# EasyEDA schematic seedrum_mosfet_v1.json
TITLE: Seedup Relay; REV: 1.0; Date: 2020-10-29; Sheet: 1/1; Drawn By: Victor Halla; Company: Seedup
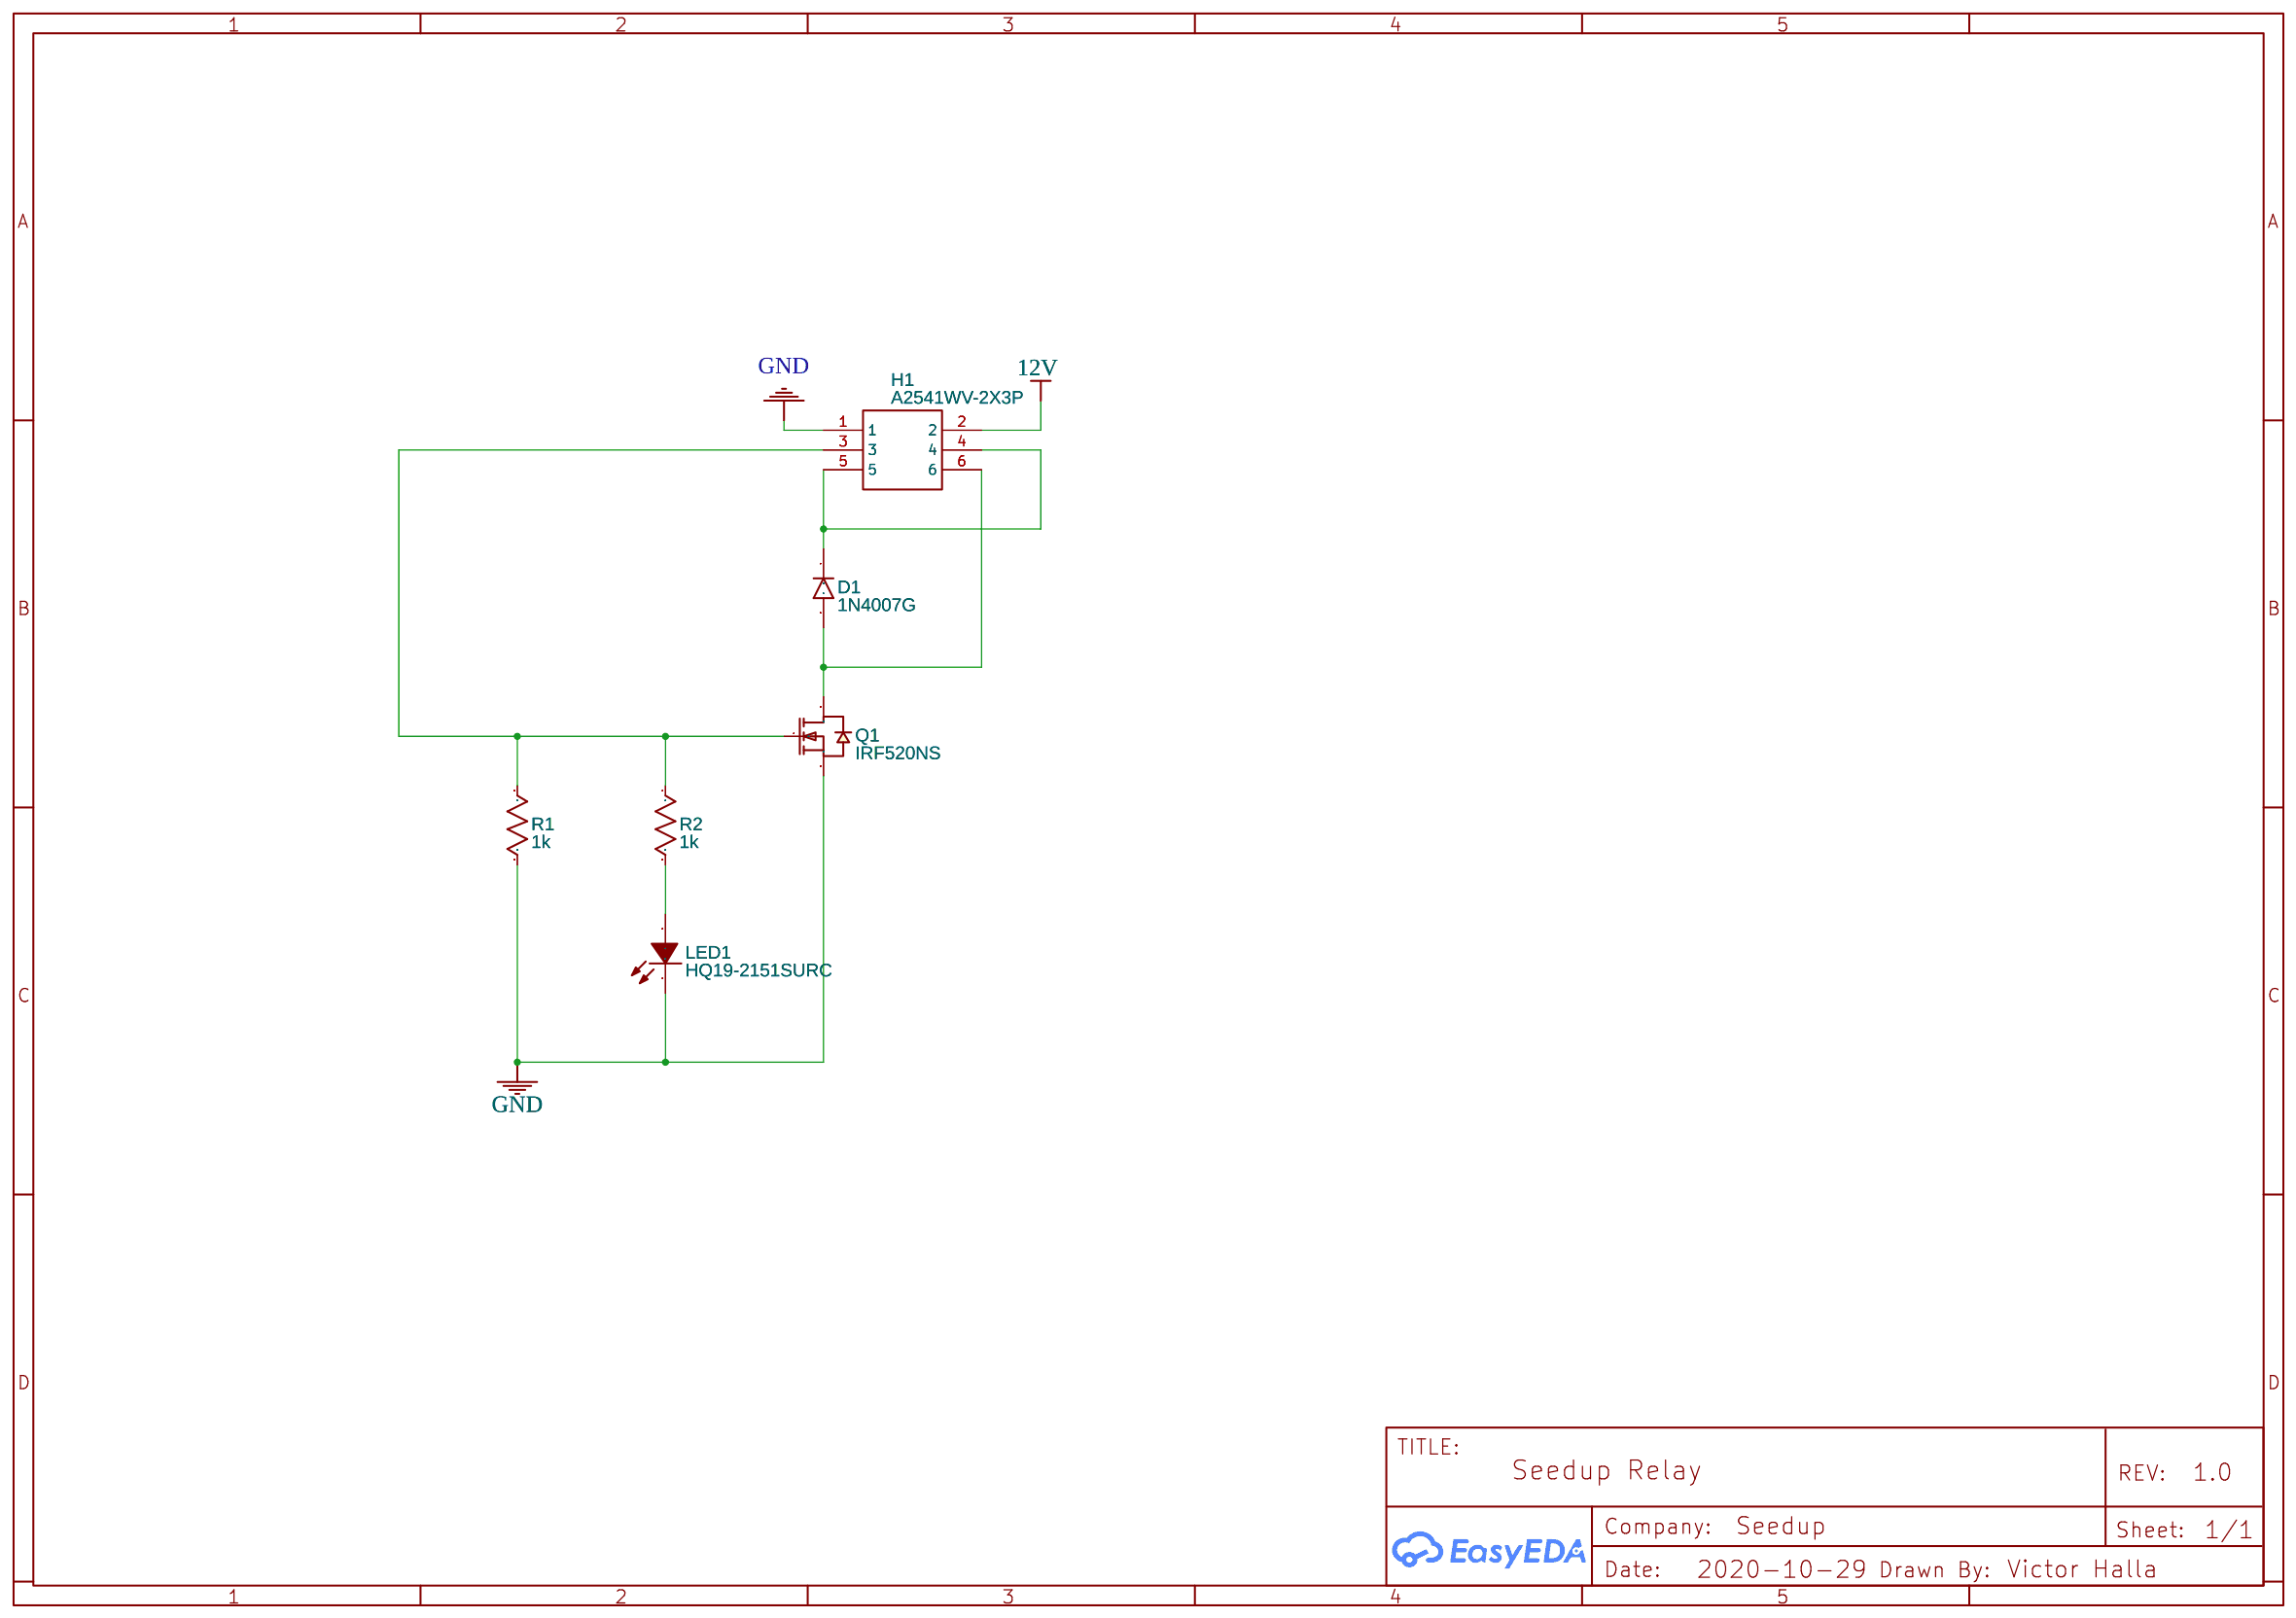
[diagram p0: schematic sheet]

## Parts
D1  1N4007G  [SMA_L4.4-W2.6-LS5.0-RD]
H1  A2541WV-2X3P  [HDR-TH_6P-P2.54-V-R2-C3-S2.54_A2541WV-2X3P]
LED1  HQ19-2151SURC  [LED0603-RD]
Q1  IRF520NS  [TO-263-2_L10.1-W9.1-P5.08-LS15.2-BR]
R1  1k  [R0603]
R2  1k  [R0603]

## Library data of the parts
D1 = 1N4007G: Supplier: LCSC; Manufacturer: SK; Contributor: LCSC; Supplier Part: C111122
H1 = A2541WV-2X3P: Supplier: LCSC; Supplier Part: C225518; Manufacturer: Changjiang Connectors; Manufacturer Part: A2541WV-2x3P; Contributor: LCSC
LED1 = HQ19-2151SURC: Supplier: LCSC; Supplier Part: C258842; Manufacturer: Harvatek Optoelectronics (Shenzhen); Contributor: LCSC
Q1 = IRF520NS: Supplier: LCSC; Supplier Part: C725067; Manufacturer: VBsemi Elec; Contributor: LCSC
R1 R2 = R_0603_US: Contributor: LCEDA_Lib

## Nets
12V: H1.2
GND: H1.1 LED1.1(K) Q1.3(S) R1.2
Net-(D1-1): D1.1(C) H1.4 H1.5
Net-(D1-2): D1.2(A) H1.6 Q1.2(D)
Net-(H1-3): H1.3 Q1.1(G) R1.1 R2.1
Net-(LED1-2): LED1.2(A) R2.2
